# Altium schematic sheet MCU Module V1.1(ASCII).SchDoc
size 420 x 297 mm
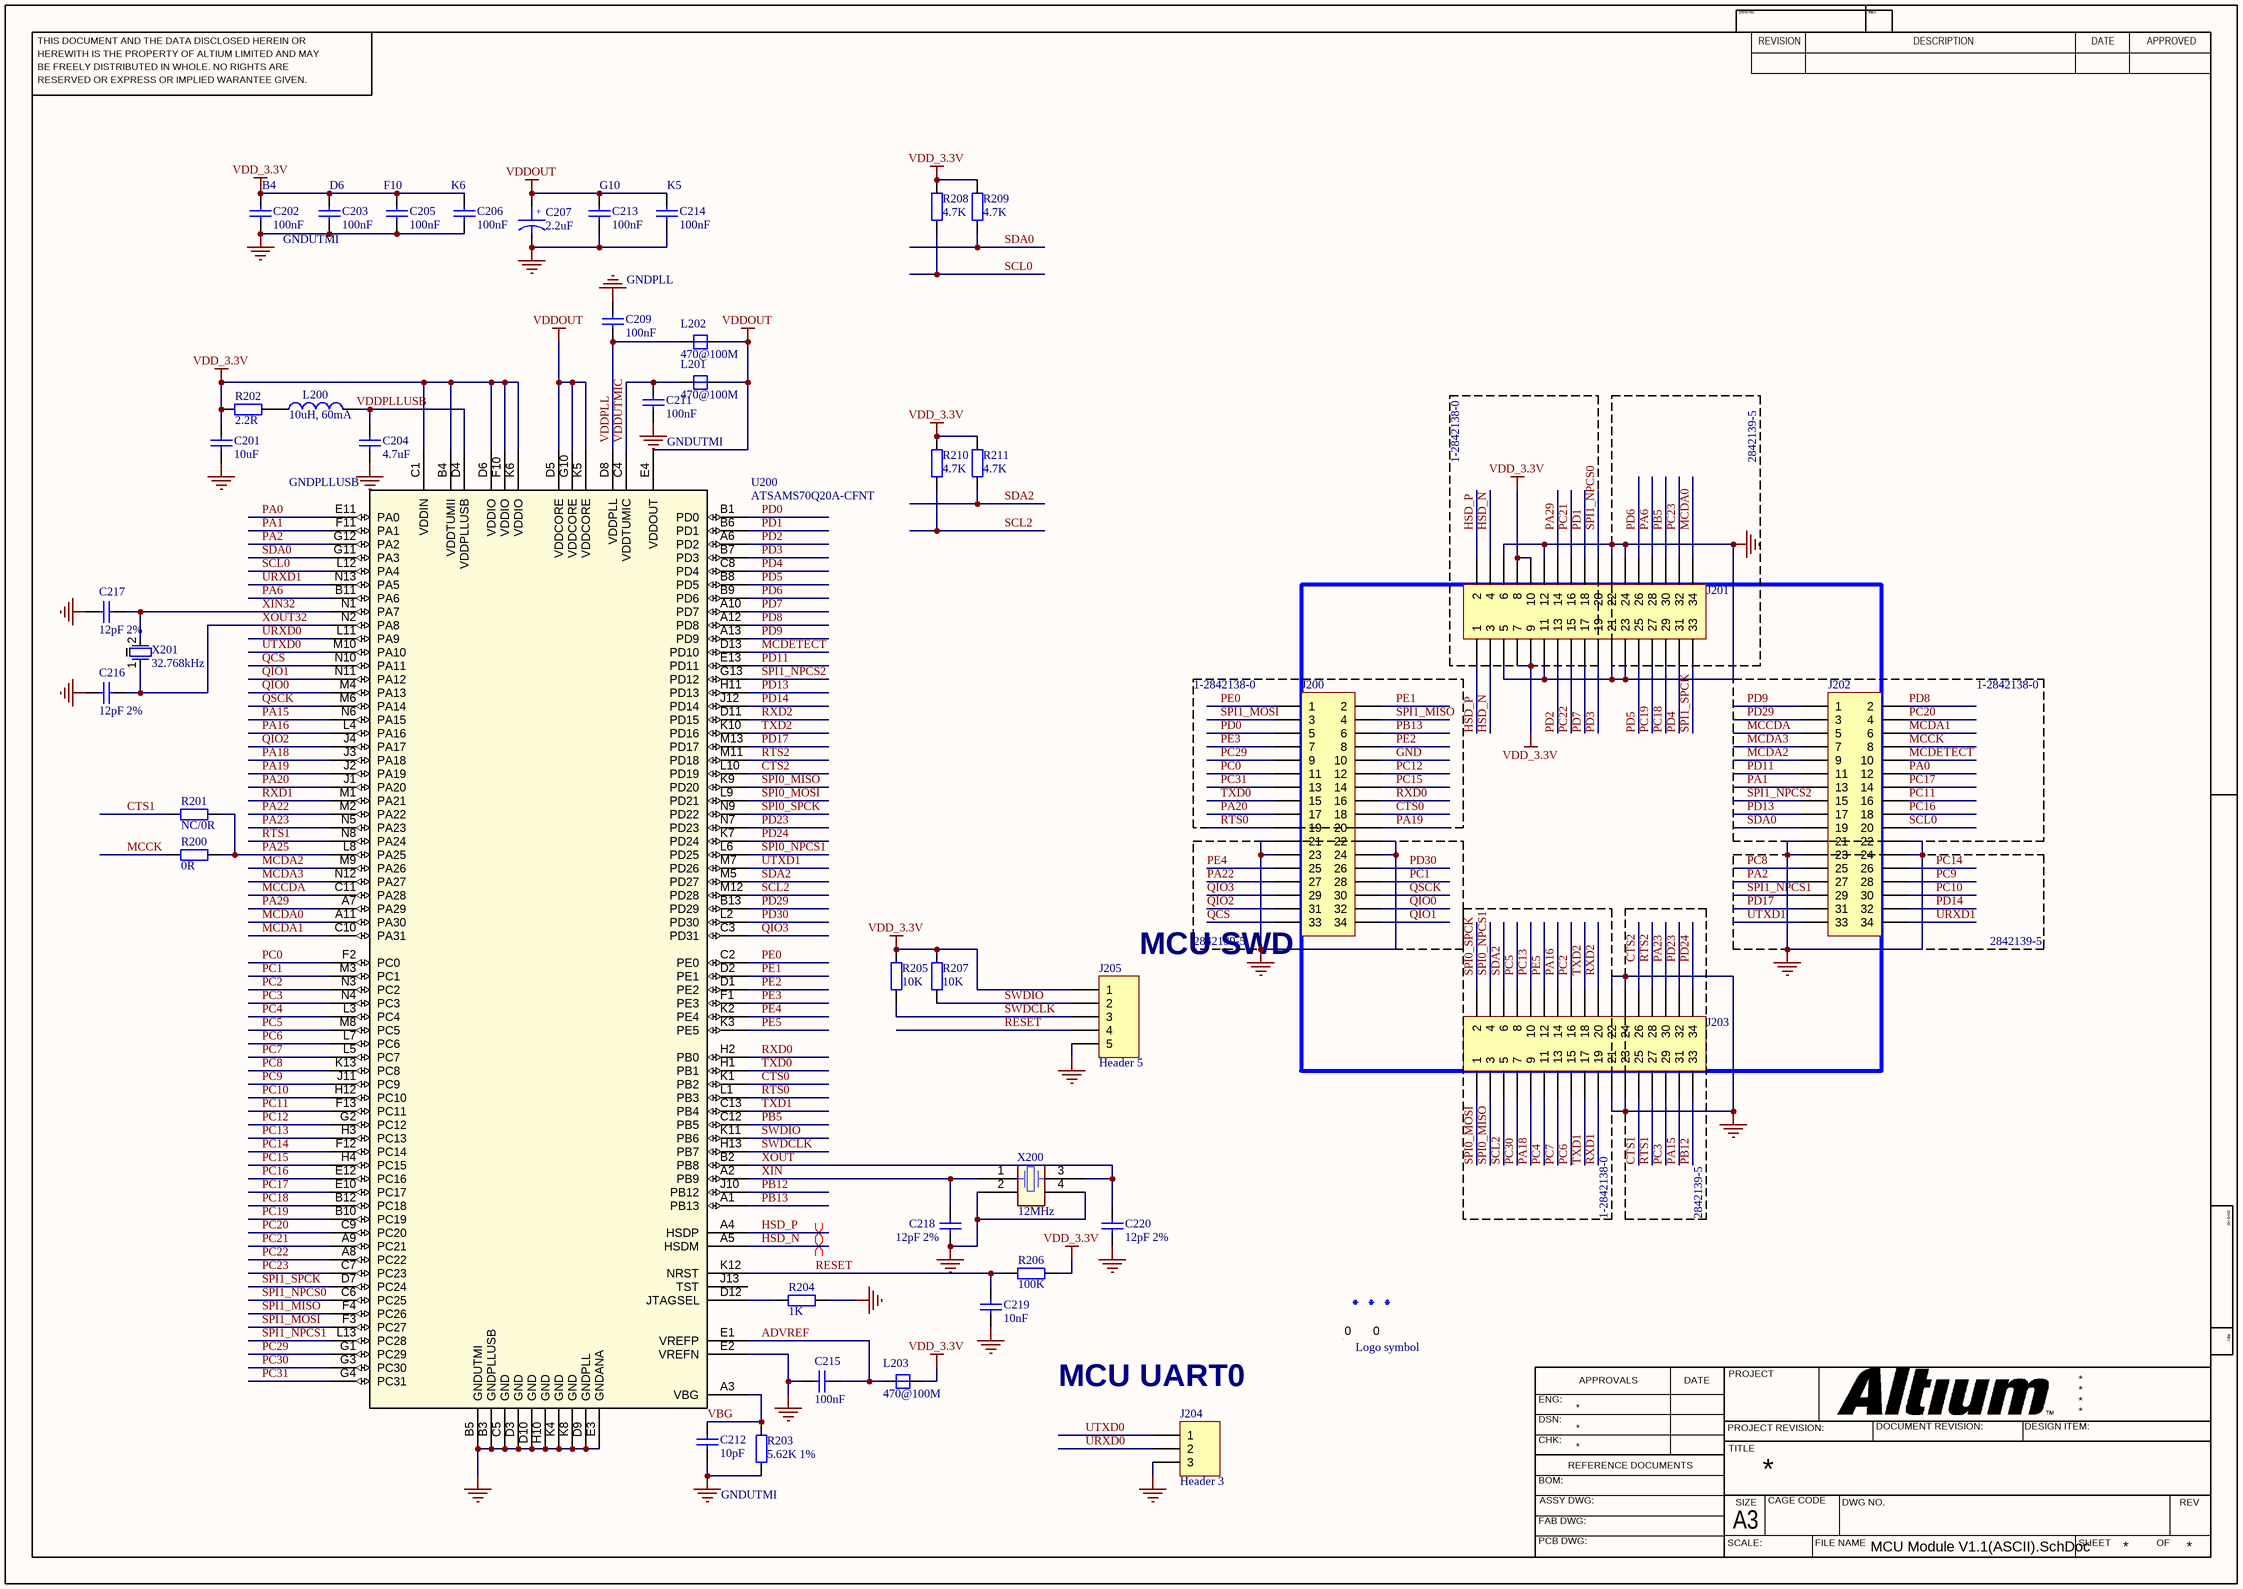
[diagram p0: MCU Module V1.1(ASCII).SchDoc]

## Parts
C201  10uF  [C_0805_2012Metric]
C202  100nF  [C_0805_2012Metric]
C203  100nF  [C_0805_2012Metric]
C204  4.7uF  [C_0805_2012Metric]
C205  100nF  [C_0805_2012Metric]
C206  100nF  [C_0805_2012Metric]
C207  2.2uF  [C_TAN_1206_3216METRIC]
C209  100nF  [C_0805_2012Metric]
C211  100nF  [C_0805_2012Metric]
C212  10pF  [C_0805_2012Metric]
C213  100nF  [C_0805_2012Metric]
C214  100nF  [C_0805_2012Metric]
C215  100nF  [C_0805_2012Metric]
C216  12pF 2%  [C_0805_2012Metric]
C217  12pF 2%  [C_0805_2012Metric]
C218  12pF 2%  [C_0805_2012Metric]
C219  10nF  [C_0805_2012Metric]
C220  12pF 2%  [C_0805_2012Metric]
Fid1  Fiducial mark  [Fiducial_1mm_Mask2mm]  (value not drawn)  (no BOM)
Fid2  Fiducial mark  [Fiducial_1mm_Mask2mm]  (value not drawn)  (no BOM)
Fid3  Fiducial mark  [Fiducial_1mm_Mask2mm]  (value not drawn)  (no BOM)
J200  Header 17X2  [HDR-TH_34P-P2.00-V-M-R2-C17-S2.00 - MALE]  (value not drawn)
J201  Header 17X2  [HDR-TH_34P-P2.00-V-M-R2-C17-S2.00 - MALE]  (value not drawn)
J202  Header 17X2  [HDR-TH_34P-P2.00-V-M-R2-C17-S2.00 - MALE]  (value not drawn)
J203  Header 17X2  [HDR-TH_34P-P2.00-V-M-R2-C17-S2.00 - MALE]  (value not drawn)
J204  Header 3  [PinHeader_1x03_P2.54mm_Vertical]
J205  Header 5  [PinHeader_1x05_P2.54mm_Vertical]
L200  10uH, 60mA  [L_0603_1608Metric]
L201  470@100M  [L_0603_1608Metric]
L202  470@100M  [L_0603_1608Metric]
L203  470@100M  [L_0603_1608Metric]
Logo_Bot?  Logo symbol  [CE-Logo_8.5x6mm_SilkScreen]  (value not drawn)
Logo_Top?  Logo symbol  [WEEE-Logo_4.2x6mm_SilkScreen]
R200  0R  [R_0805_2012Metric]
R201  NC/0R  [R_0805_2012Metric]
R202  2.2R  [R_0805_2012Metric]
R203  5.62K 1%  [R_0805_2012Metric]
R204  1K  [R_0805_2012Metric]
R205  10K  [R_0805_2012Metric]
R206  100K  [R_0805_2012Metric]
R207  10K  [R_0805_2012Metric]
R208  4.7K  [R_0805_2012Metric]
R209  4.7K  [R_0805_2012Metric]
R210  4.7K  [R_0805_2012Metric]
R211  4.7K  [R_0805_2012Metric]
U200  ATSAMS70Q20A-CFNT  [UFBGA144(6x6mm)]
X200  12MHz  [CRY-3225]
X201  32.768kHz  [Crystal 1.8x6mmm]

## Blocks framed on the sheet
1-2842138-0: J201
1-2842138-0: J200
1-2842138-0: J202

## Nets
GND: C201.2 C202.2 C203.2 C204.2 C205.2 C206.2 C207.2 C209.1 C211.2 C212.1 C213.2 C214.2 C215.1 C216.1 C217.1 C218.1 C219.2 C220.1 J200.10 J200.21 J200.22 J200.23 J200.24 J201.5 J201.6 J201.11 J201.12 J201.21 J201.22 J201.23 J201.24 J202.21 J202.22 J202.23 J202.24 J203.21 J203.22 J203.23 J203.24 J204.3 J205.5 R203.1 R204.1 U200.B3(GNDPLLUSB) U200.B5(GNDUTMI) U200.C5(GND) U200.D3(GND) U200.D9(GNDPLL) U200.D10(GND) U200.E2(VREFN) U200.E3(GNDANA) U200.H10(GND) U200.K4(GND) U200.K8(GND) X200.2 X200.4
VDD_3.3V: C201.1 C202.1 C203.1 C205.1 C206.1 J201.7 J201.8 J201.9 J201.10 J205.1 L203.2 R202.2 R205.2 R206.1 R207.2 R208.2 R209.2 R210.2 R211.2 U200.B4(VDDTUMII) U200.C1(VDDIN) U200.D6(VDDIO) U200.F10(VDDIO) U200.K6(VDDIO)
VDDOUT: C207.1 C213.1 C214.1 L201.2 L202.2 U200.D5(VDDCORE) U200.E4(VDDOUT) U200.G10(VDDCORE) U200.K5(VDDCORE)
ADVREF: C215.2 L203.1 U200.E1(VREFP)
CTS0: J200.18 U200.K1(PB2)
CTS1: J203.25 R201.2
CTS2: J203.26 U200.L10(PD19)
HSD_N: J201.3 J201.4 U200.A5(HSDM)
HSD_P: J201.1 J201.2 U200.A4(HSDP)
MCCDA: J202.5 U200.C11(PA28)
MCCK: J202.8 R200.2
MCDA0: J201.34 U200.A11(PA30)
MCDA1: J202.6 U200.C10(PA31)
MCDA2: J202.9 U200.M9(PA26)
MCDA3: J202.7 U200.N12(PA27)
MCDETECT: J202.10 U200.D13(PD10)
PA0: J202.12 U200.E11(PA0)
PA1: J202.13 U200.F11(PA1)
PA2: J202.27 U200.G12(PA2)
PA6: J201.28 U200.B11(PA6)
PA15: J203.31 U200.N6(PA15)
PA16: J203.14 U200.L4(PA16)
PA18: J203.9 U200.J3(PA18)
PA19: J200.20 U200.J2(PA19)
PA20: J200.17 U200.J1(PA20)
PA22: J200.27 U200.M2(PA22)
PA23: J203.30 U200.N5(PA23)
PA25: R200.1 R201.1 U200.L8(PA25)
PA29: J201.14 U200.A7(PA29)
PB5: J201.30 U200.C12(PB5)
PB12: J203.33 U200.J10(PB12)
PB13: J200.6 U200.A1(PB13)
PC0: J200.11 U200.F2(PC0)
PC1: J200.28 U200.M3(PC1)
PC2: J203.16 U200.N3(PC2)
PC3: J203.29 U200.N4(PC3)
PC4: J203.11 U200.L3(PC4)
PC5: J203.8 U200.M8(PC5)
PC6: J203.15 U200.L7(PC6)
PC7: J203.13 U200.L5(PC7)
PC8: J202.25 U200.K13(PC8)
PC9: J202.28 U200.J11(PC9)
PC10: J202.30 U200.H12(PC10)
PC11: J202.16 U200.F13(PC11)
PC12: J200.12 U200.G2(PC12)
PC13: J203.10 U200.H3(PC13)
PC14: J202.26 U200.F12(PC14)
PC15: J200.14 U200.H4(PC15)
PC16: J202.18 U200.E12(PC16)
PC17: J202.14 U200.E10(PC17)
PC18: J201.29 U200.B12(PC18)
PC19: J201.27 U200.B10(PC19)
PC20: J202.4 U200.C9(PC20)
PC21: J201.16 U200.A9(PC21)
PC22: J201.15 U200.A8(PC22)
PC23: J201.32 U200.C7(PC23)
PC29: J200.9 U200.G1(PC29)
PC30: J203.7 U200.G3(PC30)
PC31: J200.13 U200.G4(PC31)
PD0: J200.5 U200.B1(PD0)
PD1: J201.18 U200.B6(PD1)
PD2: J201.13 U200.A6(PD2)
PD3: J201.19 U200.B7(PD3)
PD4: J201.31 U200.C8(PD4)
PD5: J201.25 U200.B8(PD5)
PD6: J201.26 U200.B9(PD6)
PD7: J201.17 U200.A10(PD7)
PD8: J202.2 U200.A12(PD8)
PD9: J202.1 U200.A13(PD9)
PD11: J202.11 U200.E13(PD11)
PD13: J202.17 U200.H11(PD13)
PD14: J202.32 U200.J12(PD14)
PD17: J202.31 U200.M13(PD17)
PD23: J203.32 U200.N7(PD23)
PD24: J203.34 U200.K7(PD24)
PD29: J202.3 U200.B13(PD29)
PD30: J200.26 U200.L2(PD30)
PE0: J200.1 U200.C2(PE0)
PE1: J200.2 U200.D2(PE1)
PE2: J200.8 U200.D1(PE2)
PE3: J200.7 U200.F1(PE3)
PE4: J200.25 U200.K2(PE4)
PE5: J203.12 U200.K3(PE5)
QCS: J200.33 U200.N10(PA11)
QIO0: J200.32 U200.M4(PA13)
QIO1: J200.34 U200.N11(PA12)
QIO2: J200.31 U200.J4(PA17)
QIO3: J200.29 U200.C3(PD31)
QSCK: J200.30 U200.M6(PA14)
RESET: C219.1 J205.4 R206.2 U200.K12(NRST)
RTS0: J200.19 U200.L1(PB3)
RTS1: J203.27 U200.N8(PA24)
RTS2: J203.28 U200.M11(PD18)
RXD0: J200.16 U200.H2(PB0)
RXD1: J203.19 U200.M1(PA21)
RXD2: J203.20 U200.D11(PD15)
SCL0: J202.20 R208.1 U200.L12(PA4)
SCL2: J203.5 R210.1 U200.M12(PD28)
SDA0: J202.19 R209.1 U200.G11(PA3)
SDA2: J203.6 R211.1 U200.M5(PD27)
SPI0_MISO: J203.3 U200.K9(PD20)
SPI0_MOSI: J203.1 U200.L9(PD21)
SPI0_NPCS1: J203.4 U200.L6(PD25)
SPI0_SPCK: J203.2 U200.N9(PD22)
SPI1_MISO: J200.4 U200.F4(PC26)
SPI1_MOSI: J200.3 U200.F3(PC27)
SPI1_NPCS0: J201.20 U200.C6(PC25)
SPI1_NPCS1: J202.29 U200.L13(PC28)
SPI1_NPCS2: J202.15 U200.G13(PD12)
SPI1_SPCK: J201.33 U200.D7(PC24)
SWDCLK: J205.3 R205.1 U200.H13(PB7)
SWDIO: J205.2 R207.1 U200.K11(PB6)
TXD0: J200.15 U200.H1(PB1)
TXD1: J203.17 U200.C13(PB4)
TXD2: J203.18 U200.K10(PD16)
URXD0: J204.2 U200.L11(PA9)
URXD1: J202.34 U200.N13(PA5)
UTXD0: J204.1 U200.M10(PA10)
UTXD1: J202.33 U200.M7(PD26)
VBG: C212.2 R203.2 U200.A3(VBG)
VDDPLL: C209.2 L202.1 U200.D8(VDDPLL)
VDDPLLUSB: C204.1 L200.1 U200.D4(VDDPLLUSB)
VDDUTMIC: C211.1 L201.1 U200.C4(VDDTUMIC)
XIN: C218.2 U200.A2(PB9) X200.1
XIN32: C217.2 U200.N1(PA7) X201.2
XOUT: C220.2 U200.B2(PB8) X200.3
XOUT32: C216.2 U200.N2(PA8) X201.1
NetL200_2: L200.2 R202.1
NetR204_2: R204.2 U200.D12(JTAGSEL)

Not connected (* = marked no-connect by the designer): Logo_Bot? 0; Logo_Top? 0; U200 J13(TST)

## Layout directives
differential pair; differential pair class 90ohm; net class 90ohm: HSD_N, HSD_P

## Notes on the sheet
- (near C202) B4
- (near C203) D6
- (near C205) F10
- (near C206) K6
- (near C213) G10
- (near C214) K5
- (near C203) GNDUTMI
- (near C209) GNDPLL
- GNDUTMI
- 2842139-5
- GNDPLLUSB
- (near J205) MCU SWD
- 1-2842138-0
- (near J204) MCU UART0
- THIS DOCUMENT AND THE DATA DISCLOSED HEREIN OR
- HEREWITH IS THE PROPERTY OF ALTIUM LIMITED AND MAY
- DWG NO:
- REVISION
- REV:
- DESCRIPTION
- DATE
- APPROVED
- BE FREELY DISTRIBUTED IN WHOLE. NO RIGHTS ARE
- RESERVED OR EXPRESS OR IMPLIED WARANTEE GIVEN.
- ENG:
- APPROVALS
- PROJECT
- DSN:
- CHK:
- REFERENCE DOCUMENTS
- PROJECT REVISION:
- TITLE
- DOCUMENT REVISION:
- DESIGN ITEM:
- BOM:
- FAB DWG:
- PCB DWG:
- ASSY DWG:
- SCALE:
- A3
- SIZE
- CAGE CODE
- FILE NAME
- DWG NO.
- SHEET
- OF
- REV
- (in symbol A01-0492) +

## Library data of the parts
C201 = Cap Semi: CAP CER 10UF 6.3V X5R 0805; Published: 8-Jun-2000; LatestRevisionDate: 29-May-2009; LatestRevisionNote: IPC-7351 Footprint Added.; PackageReference: C1206; Publisher: Altium Limited; PackageDescription: Chip Capacitor
C202 C203 C205 C206 C209 C211 C213-C215 = Cap Semi: CAP CER 0.1UF 25V X7R 0805; Published: 8-Jun-2000; LatestRevisionDate: 29-May-2009; LatestRevisionNote: IPC-7351 Footprint Added.; PackageReference: C1206; Publisher: Altium Limited; PackageDescription: Chip Capacitor
C204 = Cap Semi: CAP CER 4.7UF 10V X5R 0805; Published: 8-Jun-2000; LatestRevisionDate: 29-May-2009; LatestRevisionNote: IPC-7351 Footprint Added.; PackageReference: C1206; Publisher: Altium Limited; PackageDescription: Chip Capacitor
C207 = A01-0492: Capacitor Tantalum 10V 2.2uF 10% ESR = 6 ohm; PartGroup: Capacitors,Tantalum; Manufacturer: Kemet; MPN: T494A225K010AT; TemperatureRange: - 55 C to + 125 C; AN: A01-0492; Value: 2.2uF; Tolerance: ±10%; Height: 1,79999995231628
C212 = Cap Semi: CAP CER 10PF 100V C0G/NP0 0805; Published: 8-Jun-2000; LatestRevisionDate: 29-May-2009; LatestRevisionNote: IPC-7351 Footprint Added.; PackageReference: C1206; Publisher: Altium Limited; PackageDescription: Chip Capacitor
C216-C218 C220 = Cap Semi: CAP CER 12PF 50V C0G/NP0 0805; Published: 8-Jun-2000; LatestRevisionDate: 29-May-2009; LatestRevisionNote: IPC-7351 Footprint Added.; PackageReference: C1206; Publisher: Altium Limited; PackageDescription: Chip Capacitor
C219 = Cap Semi: CAP CER 10000PF 10V X7R 0805; Published: 8-Jun-2000; LatestRevisionDate: 29-May-2009; LatestRevisionNote: IPC-7351 Footprint Added.; PackageReference: C1206; Publisher: Altium Limited; PackageDescription: Chip Capacitor
Fid1-Fid3 = Fiducial: Part Number: Fid-Mark; Artikkelnr Noca: N.A.; Manufacturer: *; Manufacturer Part Number: *; Datasheet: *; LatestRevisionDate: 2009-12-12; Pin Count: 1; Publisher: Nordic Semiconductor; Published: 2009-12-12; Value: *; Note: *; Supplier: *; Supplier part number: *; 2nd source Supplier: *; 2nd source part number: *; Footprint Doc: Fiducial; Artikkelnr Simpro: N.A.
J200-J203 = Header 17X2: Header, 17-Pin, Dual row; LatestRevisionDate: 17-Jul-2002; LatestRevisionNote: Re-released for DXP Platform.; Publisher: Altium Limited
J204 = Header 3: Header, 3-Pin; LatestRevisionDate: 17-Jul-2002; LatestRevisionNote: Re-released for DXP Platform.; Publisher: Altium Limited
J205 = Header 5: CONN HEADER VERT 5POS 2MM; LatestRevisionDate: 17-Jul-2002; LatestRevisionNote: Re-released for DXP Platform.; Publisher: Altium Limited
L200 = A03-0035: FIXED IND 10UH 60MA 700 MOHM SMD; PartGroup: Inductors,EMI; Manufacturer: Murata; MPN: BLM18PG471SN1; TemperatureRange: -55; AN: A03-0035; Value: 10uH, 60mA; Height: 0,800000011920929
L201-L203 = FB-M1331: FERRITE BEAD 470 OHM 0603 1LN; GateName_1: G$1; SymbolName_1: FB; DeviceName: -M1331; LibraryName: inductors-jwmiller; DeviceSetName: FB
Logo_Bot? Logo_Top? = Logo: Schematic symbol for Logo
R200 R201 = Res2: RES 0 OHM JUMPER 1/8W 0805; Published: 8-Jun-2000; LatestRevisionDate: 17-Jul-2002; LatestRevisionNote: Re-released for DXP Platform.; PackageReference: AXIAL-0.4; Publisher: Altium Limited; PackageDescription: Axial Device, Thru-Hole; 2 Leads; 0.4 in Pin Spacing
R202 = Res2: RES 2.2 OHM 5% 1/8W 0805; Published: 8-Jun-2000; LatestRevisionDate: 17-Jul-2002; LatestRevisionNote: Re-released for DXP Platform.; PackageReference: AXIAL-0.4; Publisher: Altium Limited; PackageDescription: Axial Device, Thru-Hole; 2 Leads; 0.4 in Pin Spacing
R203 = Res2: RES 5.62K OHM 1% 1/8W 0805; Published: 8-Jun-2000; LatestRevisionDate: 17-Jul-2002; LatestRevisionNote: Re-released for DXP Platform.; PackageReference: AXIAL-0.4; Publisher: Altium Limited; PackageDescription: Axial Device, Thru-Hole; 2 Leads; 0.4 in Pin Spacing
R204 = Res2: RES 1K OHM 1% 1/8W 0805; Published: 8-Jun-2000; LatestRevisionDate: 17-Jul-2002; LatestRevisionNote: Re-released for DXP Platform.; PackageReference: AXIAL-0.4; Publisher: Altium Limited; PackageDescription: Axial Device, Thru-Hole; 2 Leads; 0.4 in Pin Spacing
R205 R207 = Res2: RES 10K OHM 5% 1/8W 0805; Published: 8-Jun-2000; LatestRevisionDate: 17-Jul-2002; LatestRevisionNote: Re-released for DXP Platform.; PackageReference: AXIAL-0.4; Publisher: Altium Limited; PackageDescription: Axial Device, Thru-Hole; 2 Leads; 0.4 in Pin Spacing
R206 = Res2: RES 100K OHM 5% 1/8W 0805; Published: 8-Jun-2000; LatestRevisionDate: 17-Jul-2002; LatestRevisionNote: Re-released for DXP Platform.; PackageReference: AXIAL-0.4; Publisher: Altium Limited; PackageDescription: Axial Device, Thru-Hole; 2 Leads; 0.4 in Pin Spacing
R208-R211 = Res2: RES 4.7K OHM 5% 1/8W 0805; Published: 8-Jun-2000; LatestRevisionDate: 17-Jul-2002; LatestRevisionNote: Re-released for DXP Platform.; PackageReference: AXIAL-0.4; Publisher: Altium Limited; PackageDescription: Axial Device, Thru-Hole; 2 Leads; 0.4 in Pin Spacing
U200 = ATSAMS70Q20A-CFNT: 32-bit ARM Cortex-M7 MCUs with FPU, Audio andGraphics Interfaces, High-Speed USB, Ethernet, andAdvanced Analog; Manufacturer_Part_Number: ATSAMS70Q20A-CNT; Vendor: Microchip; Built_By: EMA_Molly; SourceLibrary: Microchip_2019-08-23_25; Copyright: Copyright (C) 2018 Accelerated Designs. All rights reserved; RefDes: RefDes; Type: DEV
X200 = A07-0042: CRYSTAL 12.0000MHZ 18PF SMD; PartGroup: Frequency devices,Crystals,SMD; Manufacturer: Fox  Electronics; MPN: FQ5032B-12.000; Value: 12.00MHz; Tolerance: Â±30ppm; TemperatureRange: 0Â°C ~ 70Â°C; AN: A07-0042; Height: 1,20000004768372
X201 = A07-0052: CRYSTAL 32.7680KHZ 12.5PF SMD; PartGroup: Frequency devices,Crystals,SMD; Manufacturer: Micro Crystal; MPN: MS1V-T1K 32.768kHz 7pF +/-20PPM TA; Tolerance: +/- 20 PPM; TemperatureRange: -40 /+85; AN: A07-0052; Value: 32.768kHz; Height: 2,07999992370605